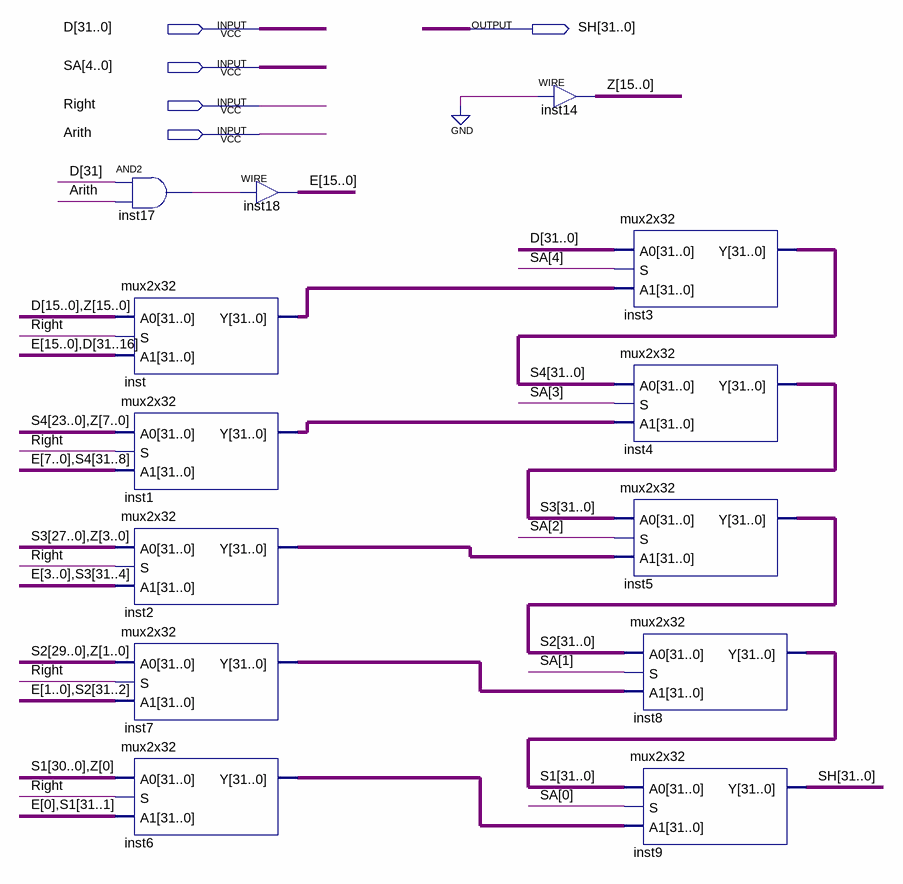
[diagram p0: schematic sheet]
// Quartus schematic shift.bdf as structural Verilog: 13 symbols, 5 pins
module shift (
  input  [31:0] D,
  input  [4:0] SA,
  input  Right,
  input  Arith,
  output [31:0] SH
);

  wire inst17_out;
  wire [15:0] E, Z;
  wire [31:0] inst1_y, inst2_y, inst6_y, inst7_y, inst_y, S1, S2, S3, S4;

  and inst17 (inst17_out, D[31], Arith);
  mux2x32 inst (.A0({D[15:0], Z}), .S(Right), .A1({E, D[31:16]}), .Y(inst_y));
  mux2x32 inst1 (.A0({S4[23:0], Z[7:0]}), .S(Right), .A1({E[7:0], S4[31:8]}), .Y(inst1_y));
  mux2x32 inst2 (.A0({S3[27:0], Z[3:0]}), .S(Right), .A1({E[3:0], S3[31:4]}), .Y(inst2_y));
  mux2x32 inst7 (.A0({S2[29:0], Z[1:0]}), .S(Right), .A1({E[1:0], S2[31:2]}), .Y(inst7_y));
  mux2x32 inst6 (.A0({S1[30:0], Z[0]}), .S(Right), .A1({E[0], S1[31:1]}), .Y(inst6_y));
  assign E = {16{inst17_out}};  // WIRE inst18
  assign Z = {16{1'b0}};  // WIRE inst14
  mux2x32 inst3 (.A0(D), .S(SA[4]), .A1(inst_y), .Y(S4));
  mux2x32 inst4 (.A0(S4), .S(SA[3]), .A1(inst1_y), .Y(S3));
  mux2x32 inst5 (.A0(S3), .S(SA[2]), .A1(inst2_y), .Y(S2));
  mux2x32 inst8 (.A0(S2), .S(SA[1]), .A1(inst7_y), .Y(S1));
  mux2x32 inst9 (.A0(S1), .S(SA[0]), .A1(inst6_y), .Y(SH));
endmodule
